# Altium schematic sheet memory.SchDoc: Bison-Board
size A4; DrawnBy: mzy2364; Revision: V1.4
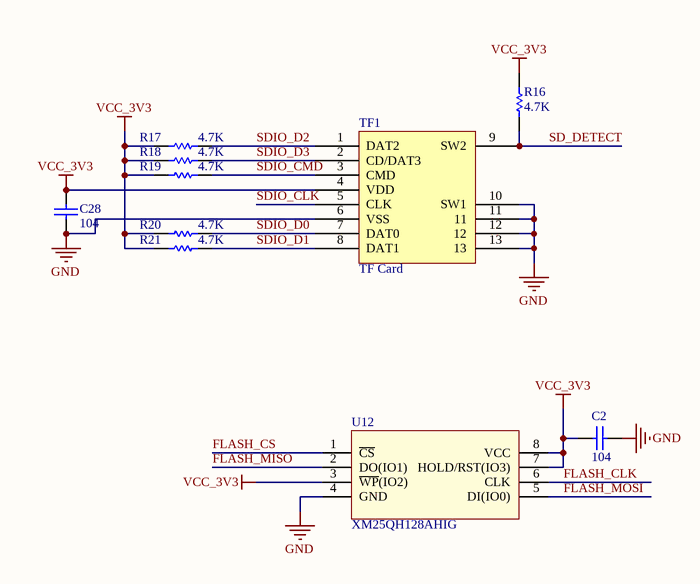
[diagram p0: memory.SchDoc]

## Parts
C2  104  [C 0603]
C28  104  [C 0603]
R16  4.7K  [R 0603]
R17  4.7K  [R 0603]
R18  4.7K  [R 0603]
R19  4.7K  [R 0603]
R20  4.7K  [R 0603]
R21  4.7K  [R 0603]
TF1  TF Card  [TF-Card]
U12  XM25QH128AHIG  [SOIC-8]

## Nets
GND: C2.2 C28.2 TF1.6(VSS) TF1.10(SW1) TF1.11 TF1.12 TF1.13 U12.4(GND)
VCC_3V3: C2.1 C28.1 R16.2 R17.1 R18.1 R19.1 R20.1 R21.1 TF1.4(VDD) U12.3(~{WP}(IO2)) U12.7(HOLD/RST(IO3)) U12.8(VCC)
FLASH_CLK: U12.6(CLK)
FLASH_CS: U12.1(~{CS})
FLASH_MISO: U12.2(DO(IO1))
FLASH_MOSI: U12.5(DI(IO0))
SD_DETECT: R16.1 TF1.9(SW2)
SDIO_CLK: TF1.5(CLK)
SDIO_CMD: R19.2 TF1.3(CMD)
SDIO_D0: R20.2 TF1.7(DAT0)
SDIO_D1: R21.2 TF1.8(DAT1)
SDIO_D2: R17.2 TF1.1(DAT2)
SDIO_D3: R18.2 TF1.2(CD/DAT3)

## Library data of the parts
C2 C28 = Cap: Capacitor
R16-R21 = RES
U12 = W25Q128